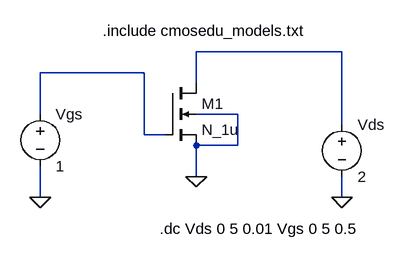
[diagram p0: schematic trabalho1.asc]
trabalho1.asc, the LTspice schematic file:
Version 4
SHEET 1 880 680
WIRE 464 64 240 64
WIRE 160 96 0 96
WIRE 240 112 240 64
WIRE 0 160 0 96
WIRE 304 160 240 160
WIRE 464 176 464 64
WIRE 160 192 160 96
WIRE 192 192 160 192
WIRE 304 208 304 160
WIRE 304 208 240 208
WIRE 240 256 240 208
WIRE 0 288 0 240
WIRE 464 288 464 256
FLAG 0 288 0
FLAG 240 256 0
FLAG 464 288 0
SYMBOL nmos4 192 112 R0
SYMATTR InstName M1
SYMATTR Value N_1u
SYMATTR Value2 l=1.5u w=3u
SYMBOL voltage 0 144 R0
SYMATTR InstName Vgs
SYMATTR Value 1
SYMBOL voltage 464 160 R0
SYMATTR InstName Vds
SYMATTR Value 2
TEXT 96 32 Left 2 !.include cmosedu_models.txt
TEXT 184 336 Left 2 !.dc Vds 0 5 0.01 Vgs 0 5 0.5

The netlist it stands for:
* trabalho1.asc
M1 N001 N002 0 0 N_1u l=1.5u w=3u
Vgs N002 0 1
Vds N001 0 2
.model NMOS NMOS
.model PMOS PMOS
.lib standard.mos
.include cmosedu_models.txt
.dc Vds 0 5 0.01 Vgs 0 5 0.5
.backanno
.end